# Altium project BLDC.PrjPcb (part 1 of 2)
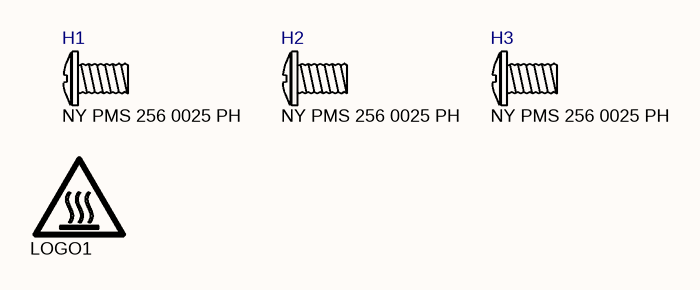
[diagram p0: BLDC_Hardware.SchDoc]
ID: 1945001; PCB_Layout: Erhan YILMAZ; PCB_Rev: E1; PRJ_Customer: Public Release; PRJ_Engineer: Erhan YILMAZ; PRJ_Number: EMOB-1945001; PRJ_Title: Beuth EMOB BLDC Controller Derived from TI TIDA-010056; SCH_Rev: E1; TechSupport: https://www.beuth-hochschule.de/b-emob
4 sheets, 175 parts. Net scope: flat (ports and power ports of the same name join across sheets).
Board file: BLDC.PcbDoc
Sheets:
  BLDC_coversheet.SchDoc
  BLDC_Hardware.SchDoc
  BLDC_Page1.SchDoc
  BLDC_Page2.SchDoc

## Sheet BLDC_coversheet.SchDoc
size B; Date: Not shown in title block; ApprovedBy: Not shown in title block; CheckedBy: Not shown in title block; Author: Not shown in title block; CompanyName: Not shown in title block; DrawnBy: Erhan YILMAZ; Engineer: Not shown in title block; Organization: Not shown in title block; DocumentNumber: 1; Revision: 1; SheetNumber: 1; SheetTotal: 4; PageSetup: Record=PageOptions|CenterHorizontal=True|CenterVertical=True|PrintScale=1.00|XCorrection=1.00|YCorrection=1.00|PrintKind=0|BorderSize=5000000|LeftOffset=0|BottomOffset=0|Orientation=2|PaperLength=1000|PaperWidth=1000|Scale=100|PaperSource=15|PrintQuality=600|MediaType=1|DitherType=10|PaperKind=Letter|PrintScaleMode=1; LogoLocation: C:\Users\erhan\Desktop\emob_bldc\design\hardware\altium\templates\schematic\Beuth-Logo.bmp; SheetTitle: Cover; DesignedBy: Erhan YILMAZ; PRJNAME: Beuth EMOB BLDC Controller Derived from TI TIDA-010056; CurrentTime: Not shown in title block; CurrentDate: Not shown in title block; Time: Not shown in title block; DocumentFullPathAndName: Not shown in title block; DocumentName: Not shown in title block; ModifiedDate: Not shown in title block; ImagePath: Not shown in title block; ProjectName: Beuth EMOB BLDC Controller Derived from TI TIDA-010056

### Notes on the sheet
- Project Name :
- Modified Date :
- Drawn By :
- Revision :
- Sheet
- of
- Designed By :
- Sheet Title :

## Sheet BLDC_Hardware.SchDoc
size B; Date: Not shown in title block; ApprovedBy: Not shown in title block; CheckedBy: Not shown in title block; Author: Not shown in title block; CompanyName: Not shown in title block; DrawnBy: Erhan YILMAZ; Engineer: Not shown in title block; Organization: Not shown in title block; Address1: Not shown in title block; Address2: Not shown in title block; Address3: Not shown in title block; Address4: Not shown in title block; DocumentNumber: 2; Revision: 1; SheetNumber: 2; SheetTotal: 4; PageSetup: Record=PageOptions|CenterHorizontal=True|CenterVertical=True|PrintScale=1.00|XCorrection=1.00|YCorrection=1.00|PrintKind=0|BorderSize=5000000|LeftOffset=0|BottomOffset=0|Orientation=2|PaperLength=1000|PaperWidth=1000|Scale=100|PaperSource=15|PrintQuality=600|MediaType=1|DitherType=10|PaperKind=Letter|PrintScaleMode=1; LogoLocation: C:\Users\erhan\Desktop\emob_bldc\design\hardware\altium\templates\schematic\Beuth-Logo.bmp; SheetTitle: Mechanic Parts; DesignedBy: Erhan YILMAZ; PRJNAME: Beuth EMOB BLDC Controller Derived from TI TIDA-010056; CurrentTime: Not shown in title block; CurrentDate: Not shown in title block; Time: Not shown in title block; DocumentFullPathAndName: Not shown in title block; DocumentName: Not shown in title block; ModifiedDate: Not shown in title block; ImagePath: Not shown in title block

### Parts
H1  NY PMS 256 0025 PH  [NY PMS 256 0025 PH]
H2  NY PMS 256 0025 PH  [NY PMS 256 0025 PH]
H3  NY PMS 256 0025 PH  [NY PMS 256 0025 PH]
LOGO1  CAUTION HOT SURFACE  [IEC_HotSurface_small]  (value not drawn)  (no BOM)

### Notes on the sheet
- Project Name :
- Modified Date :
- Drawn By :
- Revision :
- Sheet
- of
- Designed By :
- Sheet Title :

### Library data of the parts
H1-H3 = NY PMS 256 0025 PH: MACHINE SCREW PAN PHILLIPS 2-56; Manufacturer: B&F Fastener Supply; SymbolCreator: a0412235; SymbolVersion: 2013-06-24; CompType: Screw; PartNumber: NY PMS 256 0025 PH; RoHS: Y; PackageReference: Machine Screw Pan Phillips 2-56; MountType: N/A; ComponentLink1Description: Datasheet Link; ComponentLink1URL: http://www.fasnetdirect.com/refguide/Nylpanms.pdf; Publisher: Texas Instruments; LatestRevisionDate: 2017-05-31; Supplier 1: Digi-Key; Supplier Part Number 1: H530-ND
LOGO1 = IEC_HotSurface: IEC 61010-1 Hot Surface Warning; SymbolCreator: a0412235; SymbolVersion: 2011-08-22; Published: 2009-03-03; Publisher: Texas Instruments; LatestRevisionDate: 2016-03-21

## Sheet BLDC_Page1.SchDoc
size B; Date: Not shown in title block; ApprovedBy: Not shown in title block; CheckedBy: Not shown in title block; Author: Not shown in title block; CompanyName: Not shown in title block; DrawnBy: Erhan YILMAZ; Engineer: Not shown in title block; Organization: Not shown in title block; Address1: Not shown in title block; Address2: Not shown in title block; Address3: Not shown in title block; Address4: Not shown in title block; DocumentNumber: 3; Revision: 1; SheetNumber: 3; SheetTotal: 4; PageSetup: Record=PageOptions|CenterHorizontal=True|CenterVertical=True|PrintScale=1.00|XCorrection=1.00|YCorrection=1.00|PrintKind=0|BorderSize=5000000|LeftOffset=0|BottomOffset=0|Orientation=2|PaperLength=1000|PaperWidth=1000|Scale=100|PaperSource=15|PrintQuality=600|MediaType=1|DitherType=10|PaperKind=Letter|PrintScaleMode=1; LogoLocation: C:\Users\erhan\Desktop\emob_bldc\design\hardware\altium\templates\schematic\Beuth-Logo.bmp; SheetTitle: MCU and Control; DesignedBy: Erhan YILMAZ; PRJNAME: Beuth EMOB BLDC Controller Derived from TI TIDA-010056; CurrentTime: Not shown in title block; CurrentDate: Not shown in title block; Time: Not shown in title block; DocumentFullPathAndName: Not shown in title block; DocumentName: Not shown in title block; ModifiedDate: Not shown in title block; ImagePath: Not shown in title block
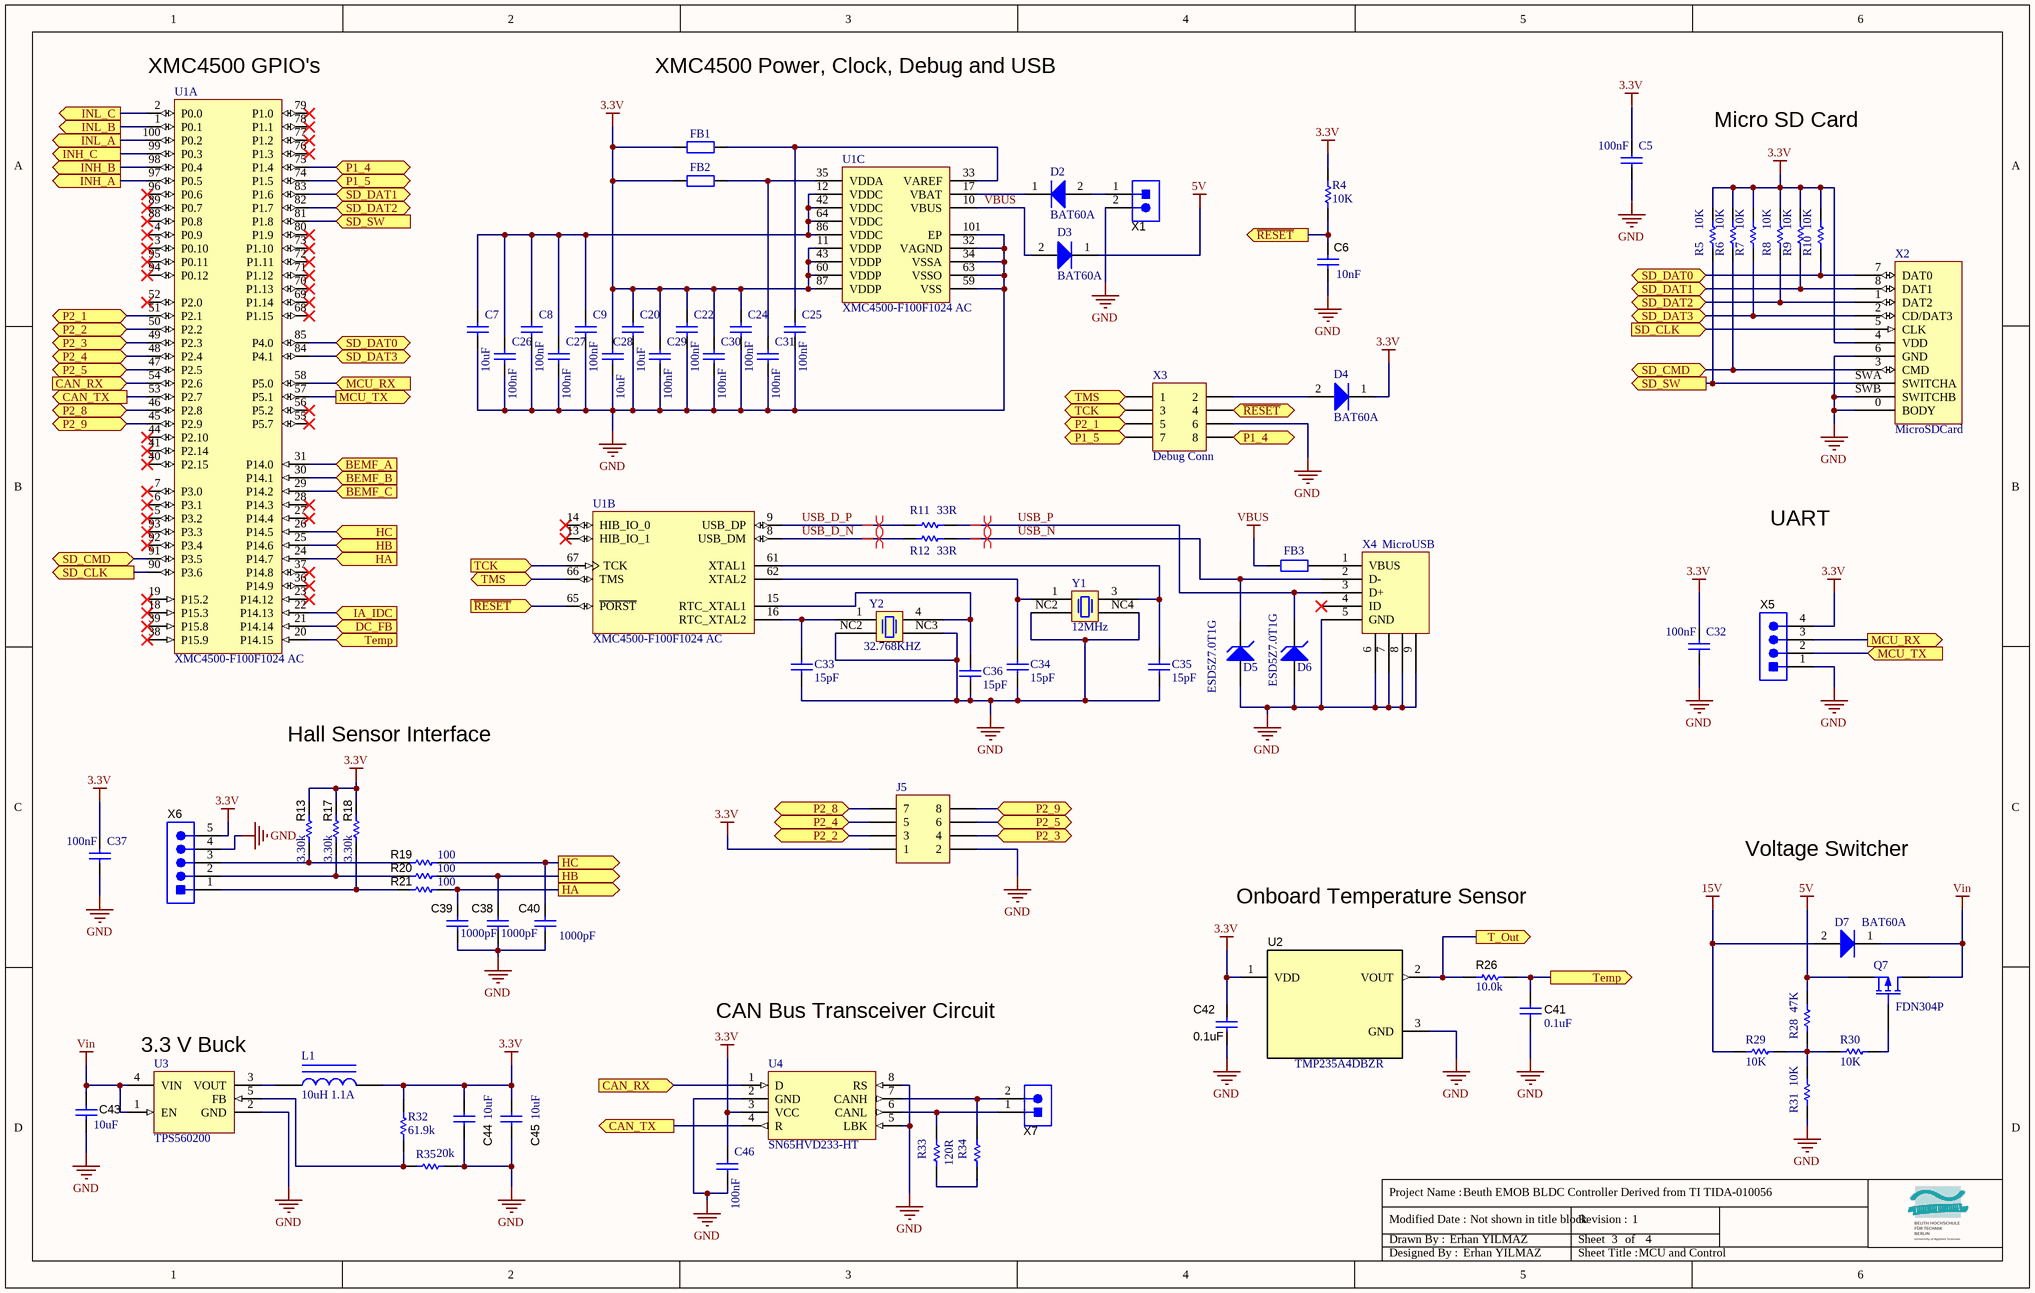
[diagram p1: BLDC_Page1.SchDoc]

### Parts
C5  100nF  [0603]
C6  ValueDisplayed: 10nF  [0603]  (hidden comment: CAP, CERM, 10 nF, 16 V, +/- 10%, X7R, 0603)
C7  10uF  [0603]
C8  100nF  [0603]
C9  100nF  [0603]
C20  10uF  [0603]
C22  100nF  [0603]
C24  100nF  [0603]
C25  100nF  [0603]
C26  100nF  [0603]
C27  100nF  [0603]
C28  10uF  [0603]
C29  100nF  [0603]
C30  100nF  [0603]
C31  100nF  [0603]
C32  100nF  [0603]
C33  15pF  [0603]
C34  15pF  [0603]
C35  15pF  [0603]
C36  15pF  [0603]
C37  100nF  [0603]
C38  ValueDisplayed: 1000pF  [0603]  (hidden comment: CAP, CERM, 1000 pF, 16 V, +/- 10%, X7R, 0603)
C39  ValueDisplayed: 1000pF  [0603]  (hidden comment: CAP, CERM, 1000 pF, 16 V, +/- 10%, X7R, 0603)
C40  ValueDisplayed: 1000pF  [0603]  (hidden comment: CAP, CERM, 1000 pF, 16 V, +/- 10%, X7R, 0603)
C41  0.1uF  [0603]
C42  0.1uF  [0603]
C43  ValueDisplayed: 10uF  [0805_HV]  (hidden comment: C3216X7R1V106M160AC)
C44  ValueDisplayed: 10uF  [0805_HV]  (hidden comment: C3216X7R1V106M160AC)
C45  ValueDisplayed: 10uF  [0805_HV]  (hidden comment: C3216X7R1V106M160AC)
C46  100nF  [0603]
D2  BAT60A  [INF-SOD323_V]
D3  BAT60A  [INF-SOD323_V]
D4  BAT60A  [INF-SOD323_V]
D5  ESD5Z7.0T1G  [ESD5Z3.3T1G]
D6  ESD5Z7.0T1G  [ESD5Z3.3T1G]
D7  BAT60A  [INF-SOD323_V]
FB1  BLM18PG600  [0603]  (value not drawn)
FB2  BLM18PG600  [0603]  (value not drawn)
FB3  BLM18PG600  [0603]  (value not drawn)
J5  Debug Conn  [2x4 Header 2.54 mm]  (value not drawn)
L1  10uH 1.1A  [Inductor 4x4x1.2]
Q7  FDN304P  [SOT-23]
R4  10K  [0603]
R5  10K  [0603]
R6  10K  [0603]
R7  10K  [0603]
R8  10K  [0603]
R9  10K  [0603]
R10  10K  [0603]
R11  33R  [0603]
R12  33R  [0603]
R13  ValueDisplayed: 3.30k  [0603]  (hidden comment: ERJ-2RKF3301X)
R17  ValueDisplayed: 3.30k  [0603]  (hidden comment: ERJ-2RKF3301X)
R18  ValueDisplayed: 3.30k  [0603]  (hidden comment: ERJ-2RKF3301X)
R19  ValueDisplayed: 100  [0603]  (hidden comment: ERJ-2GEJ101X)
R20  ValueDisplayed: 100  [0603]  (hidden comment: ERJ-2GEJ101X)
R21  ValueDisplayed: 100  [0603]  (hidden comment: ERJ-2GEJ101X)
R26  ValueDisplayed: 10.0k  [0603]  (hidden comment: ERJ-2RKF1002X)
R28  47K  [0603]
R29  10K  [0603]
R30  10K  [0603]
R31  10K  [0603]
R32  61.9k  [0603]
R33  120R  [0603]
R34  120R  [0603]  (value not drawn)
R35  20k  [0603]
U1  XMC4500-F100F1024 AC  [INF-PG-LQFP-100-11-7000X7000TP_N]  (parts A,B,C of 3)
U2  TMP235A4DBZR  [DBZ0003A_N]
U3  TPS560200  [SOT23-5]
U4  SN65HVD233-HT  [SO-8_L]
X1  61300211121  [1x2 50mill]  (value not drawn)
X2  MicroSDCard  [dm3at]
X3  Debug Conn  [2x4 Header 2.54 mm]
X4  MicroUSB  [MicroUSB]
X5  61300411121  [HDR1X4]  (value not drawn)
X6  61300511121  [HDR1X5]  (value not drawn)
X7  61300211121  [1x2 2.54  Molex]  (value not drawn)
Y1  12MHz  [X1E0000210120 TSX-3225 16MHZ 16PF]
Y2  32.768KHZ  [X32K768S019]

### Ports
BEMF_A (in), BEMF_B (in), BEMF_C (in), CAN_RX (in), CAN_TX (out), DC_FB (in), HA (in), HA (out), HB (in), HB (out), HC (in), HC (out), IA_IDC (in), INH_A (out), INH_B (out), INH_C (out), INL_A (out), INL_B (out), INL_C (out), MCU_RX (in), MCU_RX (out), MCU_TX (in), MCU_TX (out), P1_4 (bidir), P1_5 (bidir), P2_1 (bidir), P2_2 (bidir), P2_3 (bidir), P2_4 (bidir), P2_5 (bidir), P2_8 (bidir), P2_9 (bidir), SD_CLK (in), SD_CLK (out), SD_CMD (bidir), SD_DAT0 (bidir), SD_DAT1 (bidir), SD_DAT2 (bidir), SD_DAT3 (bidir), SD_SW (in), SD_SW (out), T_Out (out), TCK (in), TCK (out), Temp (in), Temp (out), TMS (bidir), ~{RESET} (in), ~{RESET} (out)

### Nets
3.3V: C5.2 C20.2 C22.2 C24.2 C28.2 C29.2 C30.2 C32.2 C37.2 C42.1 C44.1 C45.1 C46.2 D4.1(K) FB1.1 FB2.1 J5.1 L1.2 R4.1 R5.2 R6.2 R7.2 R8.2 R9.2 R10.2 R13.2 R17.2 R18.2 R32.2 U1.11(VDDP) U1.43(VDDP) U1.60(VDDP) U1.87(VDDP) U2.1(VDD) U4.3(VCC) X2.4(VDD) X5.4 X6.5
5V: D3.1(K) Q7.3(S) R28.2
15V: D7.2(A) R29.2
GND: C5.1 C6.2 C7.1 C8.1 C9.1 C20.1 C22.1 C24.1 C25.1 C26.1 C27.1 C28.1 C29.1 C30.1 C31.1 C32.1 C33.1 C34.1 C35.1 C36.1 C37.1 C38.2 C39.2 C40.2 C41.2 C42.2 C43.2 C44.2 C45.2 C46.1 D5.1(A) D6.1(A) J5.2 R31.1 R35.2 U1.32(VAGND) U1.34(VSSA) U1.59(VSS) U1.63(VSSO) U1.101(EP) U2.3(GND) U3.2(GND) U4.2(GND) U4.5(LBK) U4.8(RS) X1.2 X2.0(BODY) X2.6(GND) X2.SWB(SWITCHB) X3.6 X4.5(GND) X4.6(BODY) X4.7(BODY) X4.8(BODY) X4.9(BODY) X5.1 X6.4 Y1.NC2 Y1.NC4 Y2.NC2 Y2.NC3
VBUS: D3.2(A) FB3.1 U1.10(VBUS)
Vin: C43.1 D7.1(K) Q7.1(D) U3.1(EN) U3.4(VIN)
BEMF_A: U1.31(P14.0) ; port BEMF_A
BEMF_B: U1.30(P14.1) ; port BEMF_B
BEMF_C: U1.29(P14.2) ; port BEMF_C
CAN_RX: U1.54(P2.6) U4.1(D) ; port CAN_RX
CAN_TX: U1.53(P2.7) U4.4(R) ; port CAN_TX
DC_FB: U1.21(P14.14) ; port DC_FB
HA: C39.1 R21.2 U1.24(P14.7) ; port HA
HB: C38.1 R20.2 U1.25(P14.6) ; port HB
HC: C40.1 R19.2 U1.26(P14.5) ; port HC
IA_IDC: U1.22(P14.13) ; port IA_IDC
INH_A: U1.97(P0.5) ; port INH_A
INH_B: U1.98(P0.4) ; port INH_B
INH_C: U1.99(P0.3) ; port INH_C
INL_A: U1.100(P0.2) ; port INL_A
INL_B: U1.1(P0.1) ; port INL_B
INL_C: U1.2(P0.0) ; port INL_C
MCU_RX: U1.58(P5.0) X5.3 ; port MCU_RX
MCU_TX: U1.57(P5.1) X5.2 ; port MCU_TX
P1_4: U1.75(P1.4) X3.8 ; port P1_4
P1_5: U1.74(P1.5) X3.7 ; port P1_5
P2_1: U1.51(P2.1) X3.5 ; port P2_1
P2_2: J5.3 U1.50(P2.2) ; port P2_2
P2_3: J5.4 U1.49(P2.3) ; port P2_3
P2_4: J5.5 U1.48(P2.4) ; port P2_4
P2_5: J5.6 U1.47(P2.5) ; port P2_5
P2_8: J5.7 U1.46(P2.8) ; port P2_8
P2_9: J5.8 U1.45(P2.9) ; port P2_9
~{RESET}: C6.1 R4.2 U1.65(~{PORST}) X3.4 ; port ~{RESET}
SD_CLK: U1.90(P3.6) X2.5(CLK) ; port SD_CLK
SD_CMD: R6.1 U1.91(P3.5) X2.3(CMD) ; port SD_CMD
SD_DAT0: R10.1 U1.85(P4.0) X2.7(DAT0) ; port SD_DAT0
SD_DAT1: R9.1 U1.83(P1.6) X2.8(DAT1) ; port SD_DAT1
SD_DAT2: R8.1 U1.82(P1.7) X2.1(DAT2) ; port SD_DAT2
SD_DAT3: R7.1 U1.84(P4.1) X2.2(CD/DAT3) ; port SD_DAT3
SD_SW: R5.1 U1.81(P1.8) X2.SWA(SWITCHA) ; port SD_SW
T_Out: R26.2 U2.2(VOUT) ; port T_Out
TCK: U1.67(TCK) X3.3 ; port TCK
Temp: C41.1 R26.1 U1.20(P14.15) ; port Temp
TMS: U1.66(TMS) X3.1 ; port TMS
USB_D_N: R12.1 U1.8(USB_DM)
USB_D_P: R11.1 U1.9(USB_DP)
USB_N: D5.2(K) R12.2 X4.2(D-)
USB_P: D6.2(K) R11.2 X4.3(D+)
NetC7_2: C7.2 C8.2 C9.2 C26.2 C27.2 U1.12(VDDC) U1.42(VDDC) U1.64(VDDC) U1.86(VDDC)
NetC25_2: C25.2 FB1.2 U1.33(VAREF)
NetC31_2: C31.2 FB2.2 U1.35(VDDA)
NetC33_2: C33.2 U1.16(RTC_XTAL2) Y2.1
NetC34_2: C34.2 U1.62(XTAL2) Y1.1
NetC35_2: C35.2 U1.61(XTAL1) Y1.3
NetC36_2: C36.2 U1.15(RTC_XTAL1) Y2.4
NetD2_1: D2.1(K) U1.17(VBAT)
NetD2_2: D2.2(A) X1.1
NetD4_2: D4.2(A) X3.2
NetFB3_2: FB3.2 X4.1(VBUS)
NetL1_1: L1.1 U3.3(VOUT)
NetQ7_2: Q7.2(G) R30.1
NetR13_1: R13.1 R19.1 X6.3
NetR17_1: R17.1 R20.1 X6.2
NetR18_1: R18.1 R21.1 X6.1
NetR28_1: R28.1 R29.1 R30.2 R31.2
NetR32_1: R32.1 R35.1 U3.5(FB)
NetR33_1: R33.1 R34.1
NetR33_2: R33.2 U4.6(CANL) X7.1
NetR34_2: R34.2 U4.7(CANH) X7.2

Not connected (* = marked no-connect by the designer): U1 3(P0.10)* 4(P0.9)* 5(P3.2)* 6(P3.1)* 7(P3.0)* 13(HIB_IO_1)* 14(HIB_IO_0)* 18(P15.3)* 19(P15.2)* 23(P14.12)* 27(P14.4)* 28(P14.3)* 36(P14.9)* 37(P14.8)* 38(P15.9)* 39(P15.8)* 40(P2.15)* 41(P2.14)* 44(P2.10)* 52(P2.0)* 55(P5.7)* 56(P5.2)* 68(P1.15)* 69(P1.14)* 70(P1.13)* 71(P1.12)* 72(P1.11)* 73(P1.10)* 76(P1.3)* 77(P1.2)* 78(P1.1)* 79(P1.0)* 80(P1.9)* 88(P0.8)* 89(P0.7)* 92(P3.4)* 93(P3.3)* 94(P0.12)* 95(P0.11)* 96(P0.6)*; X4 4(ID)*

### Layout directives
differential pair: USB_D_N, USB_D_P, USB_N, USB_P

### Notes on the sheet
- (near U1) XMC4500 GPIO's
- XMC4500 Power, Clock, Debug and USB
- Micro SD Card
- UART
- Hall Sensor Interface
- Onboard Temperature Sensor
- Voltage Switcher
- (near U3) 3.3 V Buck
- CAN Bus Transceiver Circuit
- Project Name :
- Modified Date :
- Drawn By :
- Revision :
- Sheet
- of
- Designed By :
- Sheet Title :

### Library data of the parts
C5 C8 C9 C22 C24-C27 C30-C32 C37 C46 = Cap Semi: 100nF %10 50V  0603; Published: 8-Jun-2000; LatestRevisionDate: 29-May-2009; LatestRevisionNote: IPC-7351 Footprint Added.; PackageReference: C1206; Publisher: Altium Limited; PackageDescription: Chip Capacitor; Value: 100nF
C6 = CMP-0006638-2: Manufacturer: MuRata; PartNumber: GRM155R71C102KA01D; TaMin_C: -55°C; Polarized: N; SizeAreaWB_mm2: 3; Value1: Unknown; U/M: EA; Value: 10nF; TaMax_C: 125°C; SizeZ_mm: 0.6; SizeX_mm: 1; SizeY_mm: 0.5; Value2: 16V; Cap_F: 1nF; AEC Category: Q200; Supplier Part Number 2: 81-GRM155R71C102KA1D; Publisher: Texas Instruments; Supplier 2: Mouser; TempCo: X7R; Published: 2008-06-19; RoHS: Y; MountType: SMT; Supplier 1: Digi-Key; PackageReference: 0603; Tolerance_%: 10%; Cap_Case: 0603; SizeArea_mm2: 0.5; CompType: Capacitor; LatestRevisionDate: 2017-03-09; AEC Qualified: ?; VDC_V: 16V; ComponentLink1Description: Datasheet link; Supplier Part Number 1: GRM155R71C102KA01D-ND; Technology: Ceramic; ComponentLink1URL: http://search.murata.co.jp/Ceramy/PnsearchViewAction.do?HnOFG=ON&HnNFG=ON&SEL_CNT=50&sLang=en&sKey=GRM155R71C102KA01D&x=9&y=9&search=startwith
C7 C28 = Cap Semi: 10uF %10 6.3V  0603; Published: 8-Jun-2000; LatestRevisionDate: 29-May-2009; LatestRevisionNote: IPC-7351 Footprint Added.; PackageReference: C1206; Publisher: Altium Limited; PackageDescription: Chip Capacitor; Value: 10uF
C20 = Cap Semi: 10uF %10 50V  0603; Published: 8-Jun-2000; LatestRevisionDate: 29-May-2009; LatestRevisionNote: IPC-7351 Footprint Added.; PackageReference: C1206; Publisher: Altium Limited; PackageDescription: Chip Capacitor; Value: 10uF
C29 = Cap Semi: 100nF %10 6.3V  0603; Published: 8-Jun-2000; LatestRevisionDate: 29-May-2009; LatestRevisionNote: IPC-7351 Footprint Added.; PackageReference: C1206; Publisher: Altium Limited; PackageDescription: Chip Capacitor; Value: 100nF
C33-C36 = Cap: 15pf %10 50V 0603 SMD; Published: 8-Jun-2000; LatestRevisionDate: 17-Jul-2002; LatestRevisionNote: Re-released for DXP Platform.; PackageReference: RAD-0.3; Publisher: Altium Limited; PackageDescription: Radial Cap, Thru-Hole; 2 Leads; 0.3 in Pin Spacing; Value: 15pF
C38 = CMP-0006638-2: Manufacturer: MuRata; PartNumber: GRM155R71C102KA01D; TaMin_C: -55°C; Polarized: N; SizeAreaWB_mm2: 3; Value1: Unknown; U/M: EA; Value: 1000pF; TaMax_C: 125°C; SizeZ_mm: 0.6; SizeX_mm: 1; SizeY_mm: 0.5; Value2: 16V; Cap_F: 1nF; AEC Category: Q200; Supplier Part Number 2: 81-GRM155R71C102KA1D; Publisher: Texas Instruments; Supplier 2: Mouser; TempCo: X7R; Published: 2008-06-19; RoHS: Y; MountType: SMT; Supplier 1: Digi-Key; PackageReference: 0402; Tolerance_%: 10%; Cap_Case: 0603; SizeArea_mm2: 0.5; CompType: Capacitor; LatestRevisionDate: 2017-03-09; AEC Qualified: ?; VDC_V: 16V; ComponentLink1Description: Datasheet link; Supplier Part Number 1: GRM155R71C102KA01D-ND; Technology: Ceramic; ComponentLink1URL: http://search.murata.co.jp/Ceramy/PnsearchViewAction.do?HnOFG=ON&HnNFG=ON&SEL_CNT=50&sLang=en&sKey=GRM155R71C102KA01D&x=9&y=9&search=startwith
C39 C40 = CMP-0006638-2: Manufacturer: MuRata; PartNumber: GRM155R71C102KA01D; TaMin_C: -55°C; Polarized: N; SizeAreaWB_mm2: 3; Value1: Unknown; U/M: EA; Value: 1000pF; TaMax_C: 125°C; SizeZ_mm: 0.6; SizeX_mm: 1; SizeY_mm: 0.5; Cap_Case: 0402; Value2: 16V; Cap_F: 1nF; AEC Category: Q200; Supplier Part Number 2: 81-GRM155R71C102KA1D; Publisher: Texas Instruments; Supplier 2: Mouser; TempCo: X7R; Published: 2008-06-19; RoHS: Y; MountType: SMT; Supplier 1: Digi-Key; PackageReference: 0603; Tolerance_%: 10%; SizeArea_mm2: 0.5; CompType: Capacitor; LatestRevisionDate: 2017-03-09; AEC Qualified: ?; VDC_V: 16V; ComponentLink1Description: Datasheet link; Supplier Part Number 1: GRM155R71C102KA01D-ND; Technology: Ceramic; ComponentLink1URL: http://search.murata.co.jp/Ceramy/PnsearchViewAction.do?HnOFG=ON&HnNFG=ON&SEL_CNT=50&sLang=en&sKey=GRM155R71C102KA01D&x=9&y=9&search=startwith
C41 C42 = CMP-0006350-2: CAP, CERM, 0.1 uF, 10 V, +/- 10%, X7R, AEC-Q200 Grade 1, 0603; Manufacturer: MuRata; PartNumber: GCM155R71A104KA55D; TaMin_C: -55°C; Polarized: N; SizeAreaWB_mm2: 3; Value1: Unknown; U/M: EA; TaMax_C: 125°C; SizeZ_mm: 0.6; SizeX_mm: 1; SizeY_mm: 0.5; Value2: 10V; AEC Qualified: Y; Cap_F: 100nF; AEC Category: Q200; Publisher: Texas Instruments; TempCo: X7R; Published: 2008-06-19; RoHS: Y; MountType: SMT; Value: 0.1uF; Supplier 1: Mouser; PackageReference: 0402; Tolerance_%: 10%; Cap_Case: 0603; SizeArea_mm2: 0.5; CompType: Capacitor; LatestRevisionDate: 2017-03-09; VDC_V: 10V; ComponentLink1Description: Datasheet link; AEC Grade: 1; Supplier Part Number 1: 81-GCM155R71A104K5D; Technology: Ceramic; ValueDisplayed: 0.1uF; ComponentLink1URL: http://search.murata.co.jp/Ceramy/image/img/A01X/G101/ENG/GCM155R71A104KA55-01.pdf
C43-C45 = CMP-0008706-2: CAP, CERM, 10 uF, 35 V, +/- 20%, X7R, 1206_190; Manufacturer: TDK; TaMin_C: -55°C; Polarized: N; SizeAreaWB_mm2: 10.92; Value1: Unknown; U/M: EA; Value: 10uF; TaMax_C: 125°C; SizeZ_mm: 1.9; SizeX_mm: 3.2; SizeY_mm: 1.6; Cap_Case: 1206; Value2: 35V; SizeArea_mm2: 5.12; Cap_F: 10µF; AEC Category: Q200; Supplier Part Number 2: 04X3300; Publisher: Texas Instruments; Supplier 2: Newark; Supplier Part Number 3: 810-C3216X7R1V106M; TempCo: X7R; Supplier 3: Mouser; Published: 2008-06-19; RoHS: Y; MountType: SMT; Supplier 1: Digi-Key; PackageReference: 1206_190; Tolerance_%: 20%; CompType: Capacitor; LatestRevisionDate: 2017-03-09; PartNumber: C3216X7R1V106M160AC; AEC Qualified: ?; VDC_V: 35V; ComponentLink1Description: Datasheet link; Supplier Part Number 1: 445-8034-1-ND; Technology: Ceramic; ComponentLink1URL: http://product.tdk.com/en/catalog/datasheets/mlcc_commercial_general_en.pdf
D2-D4 D7 = BAT60A: Silicon Schottky Diode, -55 to 85 degC, SOD323, Reel, Green; Manufacturer: Infineon; Configuration: Single; CT (max): 35 pF; Green: TRUE; IF (max): 3,000 mA; VF (max): 370 mV; VR (max): 10 V; PackageReference: SOT323; PackageDescription: 3-Pin Small Outline Transistor Package, 1.25 x 2 mm Body, 0.65 mm Pitch; Supplier 1: Mouser; Supplier Part Number 1: N/A; Packing: Reel; Mounting Technology: Surface Mount; PartNumber: BAT60A; ComponentLink1Description: Manufacturer URL; ComponentLink1URL: http://www.infineon.com/; ComponentLink2Description: Datasheet; ComponentLink2URL: http://www.infineon.com/dgdl/bat60aseries.pdf?folderId=db3a304313d846880113def5812204a1&fileId=db3a304313d846880113def70c9304a9; ComponentLink3Description: Package Specification; ComponentLink3URL: http://www.infineon.com/dgdl/SOT323-Package_Overview.pdf?folderId=db3a30431936bc4b0119533e1dcb3c92&fileId=db3a30431936bc4b011953495f283cb1
D5 D6 = ESD5Z3.3T1G: Manufacturer: ON SEMICONDUCTOR; Manufacturer Part No: ESD5Z7.0T1G; Order Code: *; Supplier: *; Component Type: TVS DIODE; Value: ESD5Z7.0T1G
FB1-FB3 = Res2: Published: 8-Jun-2000; LatestRevisionDate: 17-Jul-2002; LatestRevisionNote: Re-released for DXP Platform.; PackageReference: AXIAL-0.4; Publisher: Altium Limited; PackageDescription: Axial Device, Thru-Hole; 2 Leads; 0.4 in Pin Spacing; Value: BLM18PG600
J5 X3 = MHDR2X4: Header, 4-Pin, Dual row; LatestRevisionDate: 17-Jul-2002; LatestRevisionNote: Re-released for DXP Platform.; Publisher: Altium Limited; Value: Header, 4-Pin, Dual row
L1 = Inductor Iron: Magnetic-Core Inductor; Description: SRN4012T Series - Semi-shielded Power Inductors; Published: 24-Mar-1999; LatestRevisionDate: 17-Jul-2002; LatestRevisionNote: Re-released for DXP Platform.; PackageReference: AXIAL-0.9; Publisher: Altium Limited; PackageDescription: Axial Device, Thru-Hole; 2 Leads; 0.9 in Pin Spacing; Value: 10uH 1.1A; Datasheet: http://www.farnell.com/datasheets/2163190.pdf
Q7 = MOSFET-P: P-Channel MOSFET; pin to pad: 2>3 3>2; Published: 8-Jun-2000; LatestRevisionDate: 17-Jul-2002; LatestRevisionNote: Re-released for DXP Platform.; PackageVersion: 1995/1996; PackageReference: E3; Publisher: Altium Limited; PackageDescription: TO, Flat Index; 3 In-Line, Axial Leads; Body Dia. 4.6mm; Lead Dia. 0.5 mm (max); Value: FDN304P
R4-R10 R29-R31 = Res1: 10k %5 SMD 0603; Published: 8-Jun-2000; LatestRevisionDate: 17-Jul-2002; LatestRevisionNote: Re-released for DXP Platform.; Publisher: Altium Limited; Value: 10K
R11 R12 = Res1: 33R 1%1 0603 smd; Published: 8-Jun-2000; LatestRevisionDate: 17-Jul-2002; LatestRevisionNote: Re-released for DXP Platform.; Publisher: Altium Limited; Value: 33R
R13 R17 R18 = CMP-0026695-1: RES, 3.30 k, 1%, 0.1 W, AEC-Q200 Grade 0, 0603; Manufacturer: Panasonic; Power_W: 100mW; TempCo: 100 ppm/C; Value_Code: 3k30; U/M: EA; Value: 3.30k; Res_ohm: 3.3k; SizeX_mm: 1; SizeY_mm: 0.5; SizeZ_mm: 0.6; Value2: 0.1W; AEC Qualified: Y; VDC_V: 50V; AEC Grade: 0; AEC Category: Q200; ComponentLink1URL: http://industrial.panasonic.com/cdbs/www-data/pdf/RDA0000/AOA0000C86.pdf; Supplier Part Number 2: 64R5278; Publisher: Texas Instruments; Supplier 2: Newark; Supplier Part Number 3: 667-ERJ-2RKF3301X; Supplier 3: Mouser; Published: 2008-06-26; RoHS: Y; Value1: 1%; MountType: SMT; Supplier 1: Digi-Key; PackageReference: 0603; Tolerance_%: 1%; SizeArea_mm2: 0.5; CompType: Resistor; LatestRevisionDate: 2017-03-09; PartNumber: ERJ-2RKF3301X; ComponentLink1Description: Datasheet link; Supplier Part Number 1: P3.30KLCT-ND; Technology: Thick Film
R19-R21 = CMP-0026993-2: RES, 100, 5%, 0.1 W, AEC-Q200 Grade 0, 0603; Manufacturer: Panasonic; Power_W: 100mW; TempCo: 200 ppm/C; Value_Code: 100R; U/M: EA; Value: 100; EIA_Code: E24; SizeX_mm: 1; SizeY_mm: 0.5; SizeZ_mm: 0.6; Value2: 0.1W; AEC Qualified: Y; AEC Grade: 0; AEC Category: Q200; Supplier Part Number 2: 65T8246; Publisher: Texas Instruments; Supplier 2: Newark; Supplier Part Number 3: 2059210; Supplier 3: Farnell; Published: 2008-06-26; RoHS: Y; Value1: 5%; MountType: SMT; Supplier 1: Digi-Key; PackageReference: 0603; Tolerance_%: 5%; Res_ohm: 100; SizeArea_mm2: 0.5; CompType: Resistor; LatestRevisionDate: 2017-03-09; PartNumber: ERJ-2GEJ101X; ComponentLink1Description: Datasheet link; Supplier Part Number 1: P100JCT-ND; Technology: Thick Film; ComponentLink1URL: https://industrial.panasonic.com/cdbs/www-data/pdf/RDA0000/AOA0000C84.pdf
R26 = CMP-0026658-1: RES, 10.0 k, 1%, 0.1 W, 0603; Manufacturer: Panasonic; Power_W: 100mW; TempCo: 100 ppm/C; Value_Code: 10k0; U/M: EA; Value: 10.0k; EIA_Code: E96; Res_ohm: 10k; SizeX_mm: 1; SizeY_mm: 0.5; SizeZ_mm: 0.6; Value2: 0.1W; VDC_V: 50V; AEC Category: Q200; ComponentLink1URL: http://industrial.panasonic.com/www-data/pdf/AOA0000/AOA0000CE2.pdf; Supplier Part Number 2: 90W2949; Publisher: Texas Instruments; Supplier 2: Newark; Supplier Part Number 3: 667-ERJ-2RKF1002X; Supplier 3: Mouser; Published: 2008-06-26; RoHS: Y; Value1: 1%; MountType: SMT; Supplier 1: Digi-Key; PackageReference: 0603; Tolerance_%: 1%; SizeArea_mm2: 0.5; CompType: Resistor; LatestRevisionDate: 2017-03-09; PartNumber: ERJ-2RKF1002X; AEC Qualified: ?; ComponentLink1Description: Datasheet link; Supplier Part Number 1: P10.0KLCT-ND; Technology: Thick Film
R28 = Res1: 47k %5 SMD 0603; Published: 8-Jun-2000; LatestRevisionDate: 17-Jul-2002; LatestRevisionNote: Re-released for DXP Platform.; Publisher: Altium Limited; Value: 47K
R32 = Res1: 61.9k 1%1 0603 smd; Published: 8-Jun-2000; LatestRevisionDate: 17-Jul-2002; LatestRevisionNote: Re-released for DXP Platform.; Publisher: Altium Limited; Value: 61.9k
R33 R34 = Res1: 120R, 1%, 0603 smd; Published: 8-Jun-2000; LatestRevisionDate: 17-Jul-2002; LatestRevisionNote: Re-released for DXP Platform.; PackageReference: AXIAL-0.3; Publisher: Altium Limited; PackageDescription: Axial Device, Thru-Hole; 2 Leads; 0.3 in Pin Spacing
  R33: Value: 120R
R35 = Res1: RES, 20.0 k, 1%, 0.063 W, AEC-Q200 Grade 0, 0603; Published: 8-Jun-2000; LatestRevisionDate: 17-Jul-2002; LatestRevisionNote: Re-released for DXP Platform.; Publisher: Altium Limited; Value: 20k
U1 = XMC4500-F100F1024 AC: 120 MHz XMC4500 MCU with 1024 KByte Program Memory, 160 KByte SRAM, 3.3 V, -40 to 150 degC, PG-LQFP-100, Tray, Green; Manufacturer: Infineon; A / D input lines (incl. FADC): 18; Digital I/O Lines: 55; Green: TRUE; I/O Operation Voltages: 3.3 V; Instruction set architecture: ARM(R) Cortex(TM)-M4 (32-bit); Max Clock Frequency: 120 MHz; Program Memory: 1,024 KByte; Type of Memory: Flash; Type of Serial I/O Interfaces: UART,SPI,I2C,I2S,LIN,CAN,Ethernet 10/100,USB; DatasheetVersion: Rev. 1.3; PackageVersion: Mar-13; PackageReference: PG-LQFP-100-11; PackageDescription: 100-Pin Plastic (Green) Low Profile Quad Flat Package, 14 x 14 mm Body, 0.5 mm Pitch; Group: XMC4500; Halogen-free: TRUE; Packing: Tray; SRAM (incl. Cache): 160 KByte; Mounting Technology: Surface Mount; PartNumber: XMC4500-F100F1024 AC; ComponentLink1Description: Manufacturer URL; ComponentLink1URL: http://www.infineon.com/; ComponentLink2Description: Datasheet; ComponentLink2URL: http://www.infineon.com/dgdl/xmc4500_ds_v1.3_2014_03.pdf?folderId=db3a30433580b3710135a47f3eb76c98&fileId=db3a304335b504400135bdca7ed86742; ComponentLink3Description: Package Specification; ComponentLink3URL: http://www.infineon.com/dgdl/PG-LQFP-100-3%2C-4%2C-8%2C-11-Package_Overview.pdf?folderId=db3a30431a5c32f2011a90c5ac475987&fileId=db3a30431a5c32f2011a9129fcd359d1
U2 = CMP-0013240-1: TMP235A4DBZR, DBZ0003A (SOP-3); Manufacturer: Texas Instruments; SizeZ_mm: 1.12; SizeX_mm: 2.5; SizeY_mm: 3; SizeArea_mm2: 7.5; CompType: IC; U/M: EA; SizeAreaWB_mm2: 14; ComponentLink1URL: https://sps06.itg.ti.com/sites/KMS/crossdivteams/altium/docs/ComponentDatasheets/TMP235DBZ MECH DRAWING.docx; Publisher: Texas Instruments; PackageDescription: SOP-3; PackageReference: DBZ0003A; LatestRevisionDate: 2017-03-09; Footprint Path 6: C:\AltiumLibraries\Footprints\TI\.PcbLib; MountType: SMT; PartNumber: TMP235A4DBZR; ComponentLink1Description: Datasheet Link; Alternate Manufacturer: Texas Instruments
U3 = TPS560200: TPS560200 4.5-V to 17-V Input, 500-mA Synchronous Step-Down Converter With  Advanced Eco-Mode™; Manufacturer: TI; Designer: Erhan YILMAZ; Value: TPS560200; Datasheet: http://www.ti.com/lit/ds/symlink/tps560200.pdf
U4 = SN65HVD233-HT: SN65HVD233-HT 3.3-V CAN Transceiver; Manufacturer: TI; Designer: Erhan YILMAZ; Value: SN65HVD233-HT; Datasheet: http://www.ti.com/lit/ds/symlink/sn65hvd233-ht.pdf
X1 X7 = CMP-0054794-2: Header, 2.54 mm, 2x1, Gold, TH; Manufacturer: Wurth Elektronik; Shrouded: N; Gender: Male; Green_REACh: Passed; Pitch_mm: 2.54; Green_Lifecycle: Active; Row_Count: 1; Cert_UL: Y; Supplier Part Number 2: 20X0948; Orientation: Vertical; PinCount: 2; ClassName: Header; Supplier 2: Newark; PackageReference: Header, 2.54mm, 2x1, TH; CompType: Header; ComponentLink1Description: Datasheet URL; Supplier 1: Digi-Key; Green_EU RoHS-2: Incomplete; ComponentLink1URL: http://katalog.we-online.de/em/datasheet/6130xx11121.pdf; Green_EU RoHS: Passed; MountType: TH; Supplier Part Number 3: 710-61300211121; RoHS: Y; Supplier Part Number 1: 732-5315-ND; ContactFinish: Gold; Supplier 3: Mouser; PartNumber: 61300211121; Color: Black
X2 = MicroSDCard: HIROSE(HRS)  DM3AT-SF-PEJM5(40)  CONNECTOR, MICRO SD, PUSH PUSH, SMT, R/A; Manufacturer: HIROSE(HRS); Manufacturer Part No: DM3AT-SF-PEJM5(40); Order Code: *; Supplier: *; Component Type: MicroSD
X4 = MicroUSB: AMPHENOL FCI  10104110-0001LF  MICRO USB, 2.0 TYPE B, RECEPTACLE, SMT; Manufacturer: AMPHENOL FCI; Manufacturer Part No: 10104110-0001LF; Component Type: Connector; Order Code: *; Supplier: *
X5 = CMP-0054798-2: Header, 2.54 mm, 4x1, Gold, TH; Manufacturer: Wurth Elektronik; Pitch_mm: 2.54; Gender: Male; Row_Count: 1; Cert_UL: Y; Shrouded: N; Supplier Part Number 3: 2356155; ClassName: Header; MountType: TH; ComponentLink1Description: Datasheet URL; PartNumber: 61300411121; PackageReference: Header, 2.54mm, 4x1, TH; Color: Black; Supplier 3: Farnell; Supplier Part Number 1: 732-5317-ND; Supplier 2: Newark; ComponentLink1URL: http://katalog.we-online.de/em/datasheet/6130xx11121.pdf; CompType: Header; PinCount: 4; Supplier 1: Digi-Key; RoHS: Y; ContactFinish: Gold; Supplier Part Number 2: 20X0951; Orientation: Vertical
X6 = CMP-0084909-1: Header, 2.54mm, 5x1, Gold, TH; Manufacturer: Wurth Elektronik; Pitch_mm: 2.54; Gender: Male; Row_Count: 1; Shrouded: N; Current_A: 3A; Voltage_V: 250V; Color: Black; PinCount: 5; ContactFinish: Gold; ComponentLink1URL: https://katalog.we-online.de/em/datasheet/6130xx11121.pdf; ComponentLink1Description: Datasheet URL; CompType: Header; MountType: TH; PartNumber: 61300511121; RoHS: Y; PackageReference: Header, 2.54mm, 5x1, TH; ClassName: Header; Orientation: Vertical
Y1 = X1E0000210120 TSX-3225 16MHZ 16PF: EPSON  X1E0000210120 TSX-3225 16MHZ 16PF  CRYSTAL, 16MHZ, 16PF, 3.2 X 2.5MM; Manufacturer: EPSON; Manufacturer Part No: X1E0000210120 TSX-3225 16MHZ 16PF; Value: 12MHz; Order Code: *; Supplier: *; Component Type: Crystal
Y2 = X32K768S019: Manufacturer: AEL CRYSTALS; Manufacturer Part No: X32K768S019; Order Code: *; Supplier: *; Component Type: Crystal; Value: 32.768KHZ